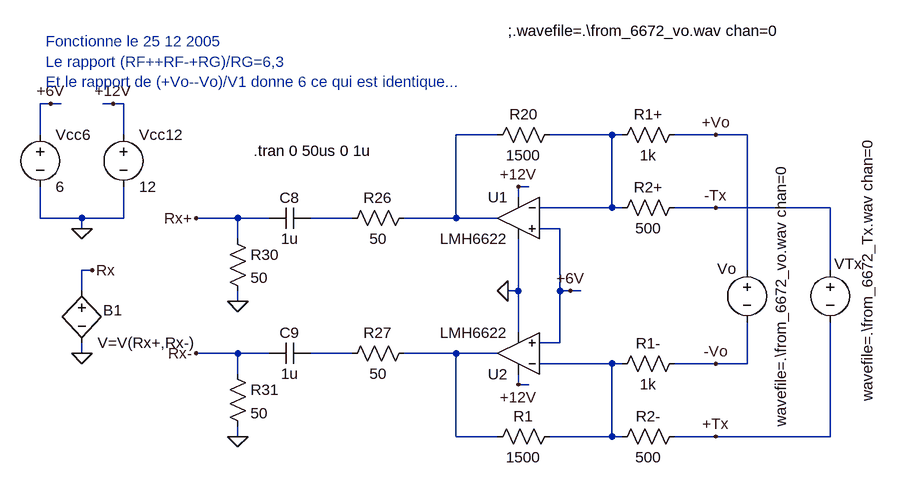
[diagram p0: schematic ADSL_Pre_Ampli_LMH6622.asc]
ADSL_Pre_Ampli_LMH6622.asc, the LTspice schematic file:
Version 4
SHEET 1 1172 680
WIRE -768 -464 -768 -512
WIRE -768 -336 -768 -384
WIRE -752 -512 -768 -512
WIRE -736 -512 -752 -512
WIRE -704 -336 -768 -336
WIRE -704 -320 -704 -336
WIRE -704 -224 -704 -256
WIRE -704 -128 -704 -144
WIRE -688 -256 -704 -256
WIRE -656 -512 -672 -512
WIRE -640 -512 -656 -512
WIRE -640 -464 -640 -512
WIRE -640 -336 -704 -336
WIRE -640 -336 -640 -384
WIRE -464 -336 -528 -336
WIRE -464 -304 -464 -336
WIRE -464 -208 -464 -224
WIRE -464 -128 -528 -128
WIRE -464 -96 -464 -128
WIRE -464 0 -464 -16
WIRE -416 -336 -464 -336
WIRE -416 -128 -464 -128
WIRE -288 -336 -352 -336
WIRE -288 -128 -352 -128
WIRE -128 -336 -208 -336
WIRE -128 -336 -128 -464
WIRE -128 -128 -208 -128
WIRE -128 0 -128 -128
WIRE -64 -464 -128 -464
WIRE -64 -336 -128 -336
WIRE -64 -128 -128 -128
WIRE -64 0 -128 0
WIRE -32 -368 -32 -384
WIRE -32 -224 -48 -224
WIRE -32 -224 -32 -304
WIRE -32 -160 -32 -224
WIRE -32 -80 -32 -96
WIRE -16 -384 -32 -384
WIRE -16 -80 -32 -80
WIRE 32 -320 0 -320
WIRE 32 -224 32 -320
WIRE 32 -144 0 -144
WIRE 32 -144 32 -224
WIRE 48 -224 32 -224
WIRE 64 -224 48 -224
WIRE 112 -464 16 -464
WIRE 112 -352 0 -352
WIRE 112 -352 112 -464
WIRE 112 -112 0 -112
WIRE 112 0 16 0
WIRE 112 0 112 -112
WIRE 128 -464 112 -464
WIRE 128 -352 112 -352
WIRE 128 -112 112 -112
WIRE 128 0 112 0
WIRE 272 -464 208 -464
WIRE 272 -352 208 -352
WIRE 272 -112 208 -112
WIRE 272 0 208 0
WIRE 320 -464 272 -464
WIRE 320 -256 320 -464
WIRE 320 -112 272 -112
WIRE 320 -112 320 -176
WIRE 448 -352 272 -352
WIRE 448 -256 448 -352
WIRE 448 0 272 0
WIRE 448 0 448 -176
FLAG -704 -320 0
FLAG -656 -512 +12V
FLAG -752 -512 +6V
FLAG 48 -224 +6V
FLAG -48 -224 0
FLAG -32 -384 +12V
FLAG -32 -80 +12V
FLAG 272 -464 +Vo
FLAG 272 -352 -Tx
FLAG 272 -112 -Vo
FLAG 272 0 +Tx
FLAG -464 -208 0
FLAG -528 -336 Rx+
FLAG -464 0 0
FLAG -528 -128 Rx-
FLAG -704 -128 0
FLAG -688 -256 Rx
SYMBOL voltage -640 -480 R0
WINDOW 123 0 0 Left 0
WINDOW 39 0 0 Left 0
SYMATTR InstName Vcc12
SYMATTR Value 12
SYMBOL voltage -768 -480 R0
WINDOW 123 0 0 Left 0
WINDOW 39 0 0 Left 0
SYMATTR InstName Vcc6
SYMATTR Value 6
SYMBOL LMH6622 -32 -336 M0
SYMATTR InstName U1
SYMBOL LMH6622 -32 -128 R180
SYMATTR InstName U2
SYMBOL res 224 -480 R90
WINDOW 0 0 56 VBottom 0
WINDOW 3 32 56 VTop 0
SYMATTR InstName R1+
SYMATTR Value 1k
SYMBOL res 224 -368 R90
WINDOW 0 0 56 VBottom 0
WINDOW 3 32 56 VTop 0
SYMATTR InstName R2+
SYMATTR Value 500
SYMBOL res 224 -128 R90
WINDOW 0 0 56 VBottom 0
WINDOW 3 32 56 VTop 0
SYMATTR InstName R1-
SYMATTR Value 1k
SYMBOL res 224 -16 R90
WINDOW 0 0 56 VBottom 0
WINDOW 3 32 56 VTop 0
SYMATTR InstName R2-
SYMATTR Value 500
SYMBOL res -192 -352 R90
WINDOW 0 0 56 VBottom 0
WINDOW 3 32 56 VTop 0
SYMATTR InstName R26
SYMATTR Value 50
SYMBOL cap -352 -352 R90
WINDOW 0 0 32 VBottom 0
WINDOW 3 32 32 VTop 0
SYMATTR InstName C8
SYMATTR Value 1u
SYMBOL res -480 -320 R0
SYMATTR InstName R30
SYMATTR Value 50
SYMBOL res -192 -144 R90
WINDOW 0 0 56 VBottom 0
WINDOW 3 32 56 VTop 0
SYMATTR InstName R27
SYMATTR Value 50
SYMBOL cap -352 -144 R90
WINDOW 0 0 32 VBottom 0
WINDOW 3 32 32 VTop 0
SYMATTR InstName C9
SYMATTR Value 1u
SYMBOL res -480 -112 R0
SYMATTR InstName R31
SYMATTR Value 50
SYMBOL res 32 -480 R90
WINDOW 0 0 56 VBottom 0
WINDOW 3 32 56 VTop 0
SYMATTR InstName R20
SYMATTR Value 1500
SYMBOL res 32 -16 R90
WINDOW 0 0 56 VBottom 0
WINDOW 3 32 56 VTop 0
SYMATTR InstName R1
SYMATTR Value 1500
SYMBOL bv -704 -240 R0
WINDOW 0 33 46 Left 0
SYMATTR InstName B1
SYMATTR Value V=V(Rx+,Rx-)
SYMBOL voltage 320 -272 R0
WINDOW 0 -46 14 Left 0
WINDOW 3 52 257 VLeft 0
SYMATTR InstName Vo
SYMATTR Value wavefile=.\from_6672_vo.wav chan=0
SYMBOL voltage 448 -272 R0
WINDOW 0 6 6 Left 0
WINDOW 3 57 218 VLeft 0
SYMATTR InstName VTx
SYMATTR Value wavefile=.\from_6672_Tx.wav chan=0
TEXT -440 -440 Left 0 !.tran 0 50us 0 1u
TEXT -760 -608 Left 0 ;Fonctionne le 25 12 2005\nLe rapport (RF++RF-+RG)/RG=6,3\nEt le rapport de (+Vo--Vo)/V1 donne 6 ce qui est identique...
TEXT -48 -624 Left 0 !;.wavefile=.\\from_6672_vo.wav chan=0

The netlist it stands for:
* ADSL_Pre_Ampli_LMH6622.asc
Vcc12 +12V 0 12
Vcc6 +6V 0 6
* U1: LMH6622 (symbol LMH6622 not available, pins judged from their places): In+=+6V In-=N005 V+=+12V V-=0 OUT=N003
* U2: LMH6622 (symbol LMH6622 not available, pins judged from their places): In+=+6V In-=N006 V+=+12V V-=0 OUT=N004
R1+ +Vo N005 1k
R2+ -Tx N005 500
R1- -Vo N006 1k
R2- +Tx N006 500
R26 N003 N001 50
C8 N001 Rx+ 1u
R30 Rx+ 0 50
R27 N004 N002 50
C9 N002 Rx- 1u
R31 Rx- 0 50
R20 N005 N003 1500
R1 N006 N004 1500
B1 Rx 0 V=V(Rx+,Rx-)
Vo +Vo -Vo wavefile=.\from_6672_vo.wav chan=0
VTx -Tx +Tx wavefile=.\from_6672_Tx.wav chan=0
.tran 0 50us 0 1u
* Fonctionne le 25 12 2005
* Le rapport (RF++RF-+RG)/RG=6,3
* Et le rapport de (+Vo--Vo)/V1 donne 6 ce qui est identique...
;.wavefile=.\from_6672_vo.wav chan=0
.backanno
.end